# Altium schematic sheet Battery Charger.SchDoc
size A; SheetNumber: 1; SheetTotal: 4
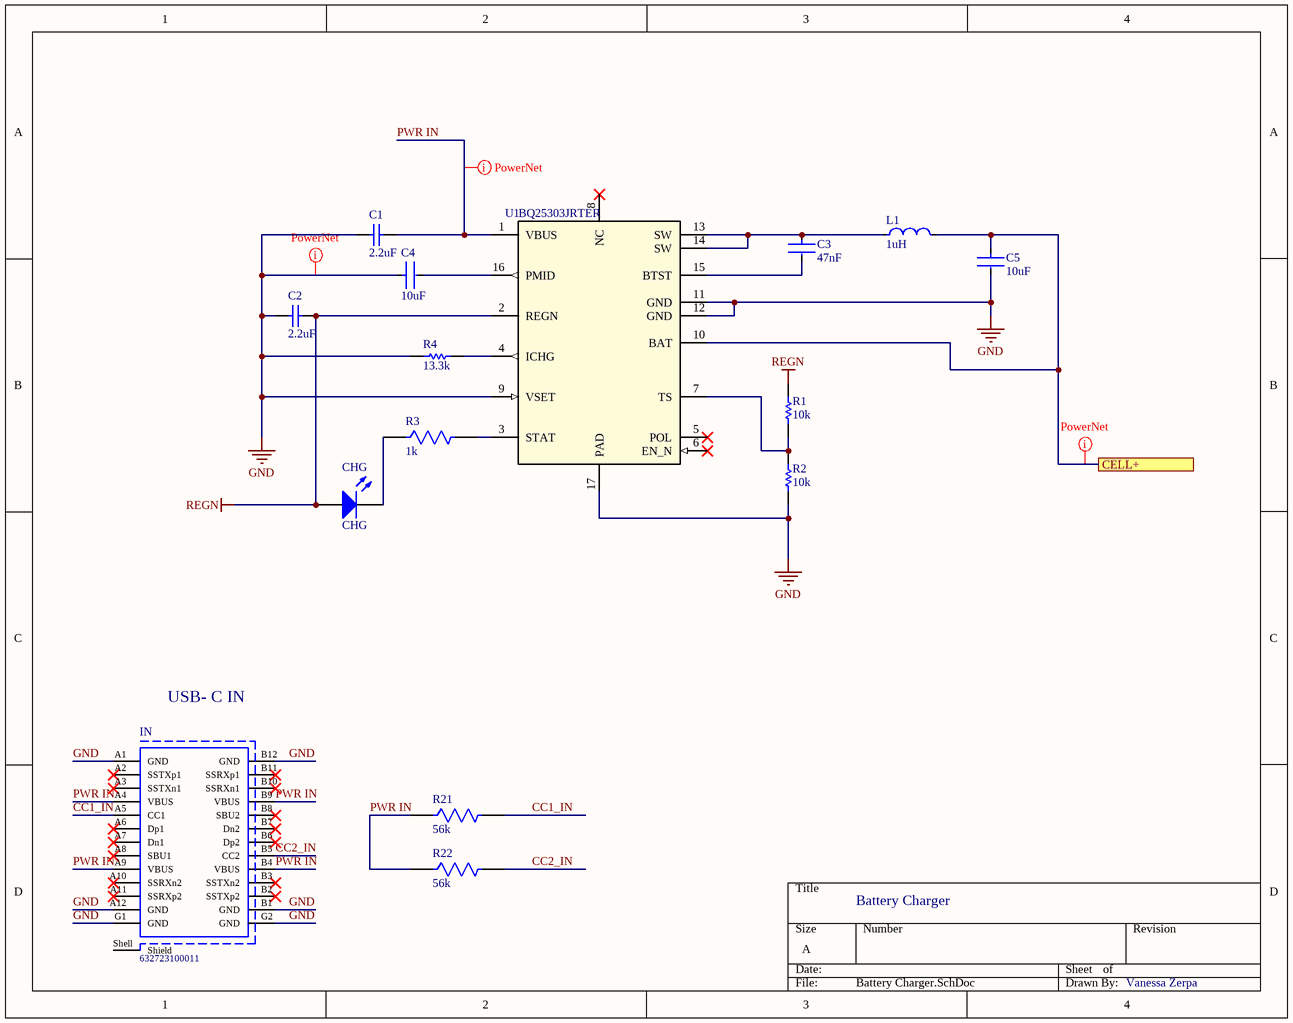
[diagram p0: Battery Charger.SchDoc]

## Parts
C1  2.2uF  [CAPC2013X152X50ML20T25]
C2  2.2uF  [CAPC2013X152X50ML20T25]
C3  47nF  [FP-C0805C-DN-MFG]
C4  10uF  [FP-C0805C-DG-MFG]
C5  10uF  [FP-C0805C-DG-MFG]
CHG  CHG  [0805_A]
IN  632723100011  [632723100011]
L1  1uH  [FP-LQM21DN_00-MFG]
R1  10k  [RESC2013X60X35NL10T20]
R2  10k  [RESC2013X60X35NL10T20]
R3  1k  [FP-CRCW0805-HPe3-IPC_A]
R4  13.3k  [RESC2013X70X40LL20T20]
R21  56k  [FP-CRCW0805-e3-IPC_B]
R22  56k  [FP-CRCW0805-e3-IPC_B]
U1  BQ25303JRTER  [RTE0016C]

## Ports
CELL+

## Nets
GND: C1.1 C2.1 C4.1 C5.2 IN.A1(GND) IN.A12(GND) IN.B1(GND) IN.B12(GND) IN.G1(GND) IN.G2(GND) R2.1 R4.1 U1.9(VSET) U1.11(GND) U1.12(GND) U1.17(PAD)
REGN: C2.2 CHG.2(A) R1.2 U1.2(REGN)
CC1_IN: IN.A5(CC1) R21.2
CC2_IN: IN.B5(CC2) R22.2
CELL+: C5.1 L1.2 U1.10(BAT) ; port CELL+
PWR IN: C1.2 IN.A4(VBUS) IN.A9(VBUS) IN.B4(VBUS) IN.B9(VBUS) R21.1 R22.1 U1.1(VBUS)
NetC3_1: C3.1 L1.1 U1.13(SW) U1.14(SW)
NetC3_2: C3.2 U1.15(BTST)
NetC4_2: C4.2 U1.16(PMID)
NetCHG_1: CHG.1(K) R3.1
NetR1_1: R1.1 R2.2 U1.7(TS)
NetR3_2: R3.2 U1.3(STAT)
NetR4_2: R4.2 U1.4(ICHG)

Not connected (* = marked no-connect by the designer): IN A2(SSTXp1)* A3(SSTXn1)* A6(Dp1)* A7(Dn1)* A8(SBU1)* A10(SSRXn2)* A11(SSRXp2)* B2(SSTXp2)* B3(SSTXn2)* B6(Dp2)* B7(Dn2)* B8(SBU2)* B10(SSRXn1)* B11(SSRXp1)* Shell(Shield); U1 5(POL)* 6(EN_N)* 8(NC)*

## Layout directives
net class PowerNets: CELL+, GND, PWR IN

## Notes on the sheet
- USB- C IN
- Battery Charger
- Vanessa Zerpa

## Library data of the parts
C1 C2 = CMP-2007-04514-1: Part Number: 08053C225KAT2A; Manufacturer: AVX Interconnect / Elco
C3 = CMP-2007-03315-2: CAP CER 0.047UF 25V 5% NP0 0805; Manufacturer Part Number: C0805C473J3GACTU; Manufacturer: KEMET; Tolerance: 0.05; Temperature Coefficient: 30ppm/°C; Material: Ceramic; Capacitance: 47,000 pF; Value: 47,000 pF; Temperature Characteristic: C0G; Device Class L3: Ceramic Capacitors; Temperature Range Low: -55°C; Category: Cap; Lead Free: Yes; Digikey Description: CAP CER 0.047UF 25V 5% NP0 0805; Ipc Land Pattern Name: CAPC200125X78; Device Class L1: Passive Components; Device Class L2: Capacitors; Temperature: -55°C to +125°C; Voltage Rating: 25 V; Height: 0.88mm; Package: C0805C-DN; Automotive: No; Octopart: https://octopart.com/c0805c473j3gactu-kemet-9563153; ComponentLink2Description: Datasheet; Mouser Description: Multilayer Ceramic Capacitors MLCC - SMD/SMT 25volts 0.047uF 5% C0G; ComponentLink2URL: https://content.kemet.com/datasheets/KEM_C1003_C0G_SMD.pdf; RoHS: TRUE; Temperature Range High: +125°C
C4 C5 = CMP-2007-03243-2: CAP CER 10UF 10V X5R 0805; Manufacturer Part Number: C0805C106K8PACTU; Manufacturer: Kemet; 3DS Part Number: 220-00001; Tolerance: 10%; Temperature Coefficient: 15%; Material: Ceramic; Device Class L2: Capacitors; Device Class L1: Passive Components; ComponentLink2URL: https://content.kemet.com/datasheets/KEM_C1006_X5R_SMD.pdf; Height: 1.4mm; Lead Free: Yes; Digikey Description: CAP CER 10UF 10V X5R 0805; Octopart: https://octopart.com/c0805c106k8pactu-kemet-98697; Capacitance: 10uF; Value: 10uF; Temperature Range Low: -55°C; Temperature: -55°C to +85°C; Automotive: No; Mouser Description: CAP CER 10UF 10V X5R 0805; Ipc Land Pattern Name: CAPC200125X125; Temperature Range High: +85°C; Voltage: 10V; RoHS: TRUE; Device Class L3: Ceramic Capacitors; ComponentLink2Description: Datasheet; Voltage Rating: 10V; Package: C0805C-DG; Temperature Characteristic: X5R; Category: Cap
CHG = CMP-1426-00011-1: SMD mono-color Chip LED, WL-SMCW, Red; PartNumber: 150080RS75000; Manufacturer: Wuerth Elektronik; Color: Red; PackageReference: 0805_A; ComponentLink2Description: Datasheet; ComponentLink1URL: http://www.we-online.com; ComponentLink1Description: Manufacturer URL; ComponentLink2URL: http://katalog.we-online.com/led/datasheet/150080RS75000.pdf
IN = CMP-1502-03213-1: USB 3.1 Type C Receptacle WR-COM, Horizontal, SMT / THT; Manufacturer: Wurth Elektronik; Working Voltage: 20VDC; Rated Current: 5A; Contact Resistance: 30mOhm; Operating Temperature: -40to105degC; Publisher: WurthElektronik; Gender: Receptacle; Part Number: 632723100011; Mounting Technology: SMT/THT; Datasheet URL: https://katalog.we-online.de/em/datasheet/632723x00011%282%29.pdf; Connector Type: USB3.1TypeC; Manufacturer URL: http://www.we-online.de; Orientation: Horizontal; Package Reference: 632723100011; Packaging: TapeandReel
L1 = CMP-06042-012978-1: Multilayer Type Inductor for General Circuits, 0805 (2012), 1μH, 10%, 0.4Ω, 50mA; Q Factor: 45; Test Frequency: 10MHz; DC Resistance (DCR): 400mR; Core Material: Ferrite; Shielding: Shielded; Self Resonant Frequency: 107MHz; Mount: Surface Mount; Depth: 1.45mm; Current Rating: 50mA; Lead Free: Lead Free; Height - Seated (Max): 0.041inch; Inductance Tolerance: 10%; Min Operating Temperature: -40°C; Height: 0.85mm; Radiation Hardening: No; Width: 1.25mm; Length: 2mm; Case Code (Imperial): 0805; Termination: SMD/SMT; Package Quantity: 1; Max Operating Temperature: 85°C; Case Code (Metric): 2012; Case/Package: 0805; Max DC Current: 50mA; DC Current: 50mA; Inductance: 1uH; Military Standard: Not; REACH SVHC: No SVHC; Packaging: Tape and Reel; Tolerance: 10%
R1 R2 = CMP-1659-00013-4: Chip Resistor, 10 KOhm, +/- 1%, 0.125 W, -55 to 155 degC, 0805 (2012 Metric), RoHS, Tape and Reel; Manufacturer: Yageo; Voltage Rating: 150 V; Mount: Surface Mount; ComponentLink1Description: Manufacturer URL; ComponentLink2URL: http://www.yageo.com/documents/recent/PYu-RC_Group_51_RoHS_L_04.pdf; Pins: 2; Length: 2 mm; Min Operating Temperature: -55 degC; Height: 0.5 mm; Mounting Technology: Surface Mount; RoHSCompliant: true; REACH SVHC: No SVHC; ComponentLink1URL: http://www.yageo.com/; Max Operating Temperature: 155 degC; PackageReference: 0805; DatasheetVersion: Rev. 4, 02/2016; Package Quantity: 5000; Packaging: Tape and Reel; ComponentLink2Description: Datasheet; PackageDescription: 2-Pin Surface Mounted Device, Body 2 x 1.25 mm
R3 = CMP-02407-004529-1: RES Thick Film, 1kΩ, 1%, 0.5W, 100ppm/°C, 0805; Resistance: 1kR; Voltage Rating (DC): 150V; Power Rating: 330mW; Contact Plating: Tin; Composition: Thick Film; Packaging: Tape and Reel; Min Operating Temperature: -55°C; Weight: 0.000194oz; Case/Package: 0805; Case Code (Imperial): 0805; Case Code (Metric): 2012; Height: 0.5mm; Military Standard: Not; Lead Free: Lead Free; Voltage Rating: 150V; Number of Pins: 2; Max Operating Temperature: 155°C; Package Quantity: 5000; Mount: Surface Mount; Temperature Coefficient: 100ppm/°C; Tolerance: 1%; Radiation Hardening: No; Depth: 1.25mm; Length: 2mm; Termination: Solder; Width: 1.2mm
R4 = CMP-2001-04421-1: Manufacturer: Panasonic; Part Number: ERJ-6ENF1332V
R21 R22 = CMP-2001-04015-2: RES Thick Film, 56kΩ, 1%, 0.125W, 100ppm/°C, 0805; Resistance: 56kR; Power Rating: 125mW; Voltage Rating: 150V; Depth: 1.25mm; Contact Plating: Tin; Package Quantity: 10; Min Operating Temperature: -55°C; Case/Package: 0805; Packaging: Tape and Reel; Lead Free: Lead Free; Case Code (Imperial): 0805; Tolerance: 1%; Height: 0.45mm; Max Operating Temperature: 155°C; Case Code (Metric): 2012; Number of Pins: 2; Width: 1.25mm; Mount: Surface Mount; Voltage Rating (DC): 150V; Max Power Dissipation: 125mW; Weight: 0.000194oz; Termination: SMD/SMT; Length: 2mm; Radiation Hardening: No; Composition: Thick Film; Features: Automotive AEC-Q200; Number of Terminations: 2; Temperature Coefficient: 100ppm/°C; Military Standard: Not
U1 = BQ25303JRTER: Standalone 1-cell 17-V, 3.0-A battery charger with JEITA battery temperature monitoring 16-WQFN -40 to 85; Mfr_Name: Texas Instruments; Type: DEV; RefDes: RefDes; Copyright: Copyright (C) 2021 Ultra Librarian. All rights reserved.; Manufacturer_Part_Number: BQ25303JRTER; Supplier 1: Mouser; Manufacturer: Texas Instruments; Manufacturer Part Number: BQ25303JRTER; RoHS: Yes; Category: Integrated Circuits (ICs); Stock 1: 48; Pricing 1: 1=2.18000, 10=1.97000, 25=1.86000, 50=1.86000, 100=1.59000, 250=1.49000, 500=1.30000, 1000=1.08000, 3000=1.07000, 10000=1.07000 (USD); Supplier Part Number 1: 595-BQ25303JRTER